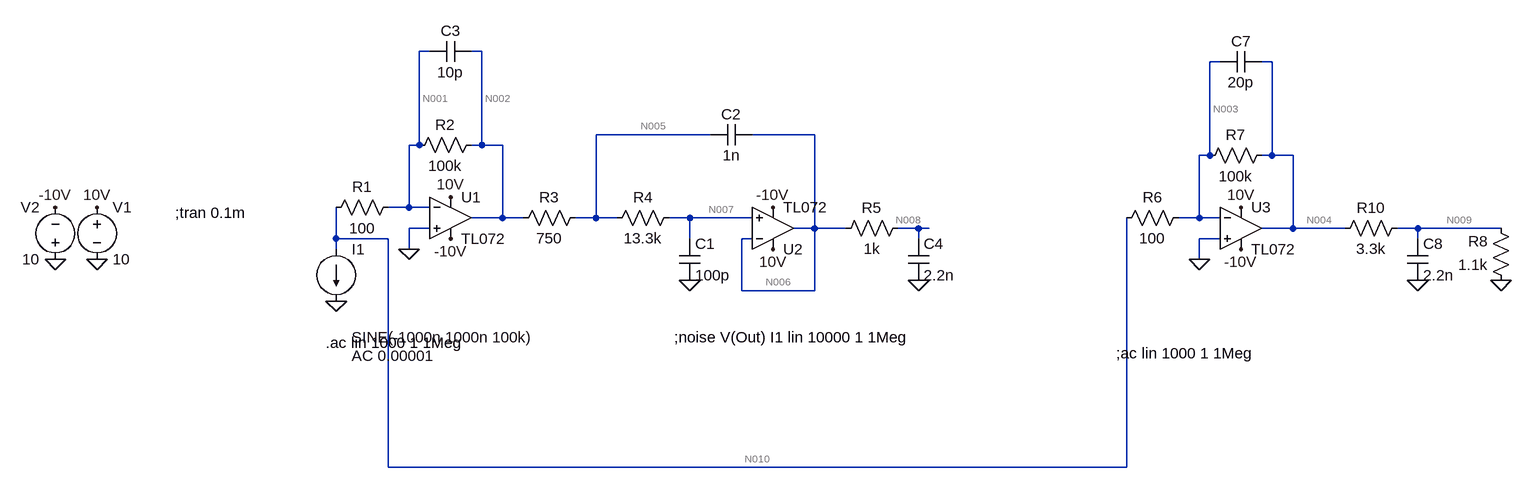
[diagram p0: schematic Model.asc]
Model.asc, the LTspice schematic file:
Version 4
SHEET 1 2156 680
WIRE 64 -96 48 -96
WIRE 144 -96 128 -96
WIRE 1280 -80 1264 -80
WIRE 1360 -80 1344 -80
WIRE 496 32 320 32
WIRE 656 32 560 32
WIRE 48 48 48 -96
WIRE 48 48 32 48
WIRE 144 48 144 -96
WIRE 144 48 128 48
WIRE 176 48 144 48
WIRE 1264 64 1264 -80
WIRE 1264 64 1248 64
WIRE 1360 64 1360 -80
WIRE 1360 64 1344 64
WIRE 1392 64 1360 64
WIRE 32 144 32 48
WIRE 32 144 0 144
WIRE 64 144 32 144
WIRE 176 160 176 48
WIRE 176 160 128 160
WIRE 208 160 176 160
WIRE 320 160 320 32
WIRE 320 160 288 160
WIRE 352 160 320 160
WIRE 464 160 432 160
WIRE 560 160 464 160
WIRE 1248 160 1248 64
WIRE 1248 160 1216 160
WIRE 1280 160 1248 160
WIRE 64 176 32 176
WIRE 656 176 656 32
WIRE 656 176 624 176
WIRE 704 176 656 176
WIRE 816 176 784 176
WIRE 832 176 816 176
WIRE 1392 176 1392 64
WIRE 1392 176 1344 176
WIRE 1472 176 1392 176
WIRE 1584 176 1552 176
WIRE 1712 176 1584 176
WIRE -80 192 -80 144
WIRE 0 192 -80 192
WIRE 464 192 464 160
WIRE 560 192 544 192
WIRE 816 192 816 176
WIRE 1280 192 1248 192
WIRE 1584 192 1584 176
WIRE -80 208 -80 192
WIRE 32 208 32 176
WIRE 1248 224 1248 192
WIRE 544 272 544 192
WIRE 656 272 656 176
WIRE 656 272 544 272
WIRE 0 544 0 192
WIRE 1136 544 1136 160
WIRE 1136 544 0 544
FLAG 32 208 0
FLAG -80 288 0
FLAG 96 128 10V
FLAG 96 192 -10V
FLAG -512 144 -10V
FLAG -448 144 10V
FLAG -512 224 0
FLAG -448 224 0
FLAG 592 208 10V
FLAG 592 144 -10V
FLAG 464 256 0
FLAG 816 256 0
FLAG 1248 224 0
FLAG 1312 144 10V
FLAG 1312 208 -10V
FLAG 1584 256 0
FLAG 1712 256 0
SYMBOL OpAmps\\TL072 96 96 R0
SYMATTR InstName U1
SYMBOL res 16 128 R90
WINDOW 0 0 56 VBottom 2
WINDOW 3 32 56 VTop 2
SYMATTR InstName R1
SYMATTR Value 100
SYMBOL res 144 32 R90
WINDOW 0 0 56 VBottom 2
WINDOW 3 32 56 VTop 2
SYMATTR InstName R2
SYMATTR Value 100k
SYMBOL current -80 208 R0
WINDOW 3 24 136 Left 2
WINDOW 123 24 164 Left 2
WINDOW 39 0 0 Left 0
SYMATTR Value SINE(-1000n 1000n 100k)
SYMATTR Value2 AC 0.00001
SYMATTR InstName I1
SYMBOL voltage -448 128 R0
WINDOW 123 0 0 Left 0
WINDOW 39 0 0 Left 0
SYMATTR InstName V1
SYMATTR Value 10
SYMBOL voltage -512 240 R180
WINDOW 0 24 96 Left 2
WINDOW 3 24 16 Left 2
WINDOW 123 0 0 Left 0
WINDOW 39 0 0 Left 0
SYMATTR InstName V2
SYMATTR Value 10
SYMBOL res 304 144 R90
WINDOW 0 0 56 VBottom 2
WINDOW 3 32 56 VTop 2
SYMATTR InstName R3
SYMATTR Value 750
SYMBOL OpAmps\\TL072 592 240 M180
SYMATTR InstName U2
SYMBOL res 448 144 R90
WINDOW 0 0 56 VBottom 2
WINDOW 3 32 56 VTop 2
SYMATTR InstName R4
SYMATTR Value 13.3k
SYMBOL cap 448 192 R0
SYMATTR InstName C1
SYMATTR Value 100p
SYMBOL cap 560 16 R90
WINDOW 0 0 32 VBottom 2
WINDOW 3 32 32 VTop 2
SYMATTR InstName C2
SYMATTR Value 1n
SYMBOL cap 128 -112 R90
WINDOW 0 0 32 VBottom 2
WINDOW 3 32 32 VTop 2
SYMATTR InstName C3
SYMATTR Value 10p
SYMBOL res 800 160 R90
WINDOW 0 0 56 VBottom 2
WINDOW 3 32 56 VTop 2
SYMATTR InstName R5
SYMATTR Value 1k
SYMBOL cap 800 192 R0
SYMATTR InstName C4
SYMATTR Value 2.2n
SYMBOL OpAmps\\TL072 1312 112 R0
SYMATTR InstName U3
SYMBOL res 1232 144 R90
WINDOW 0 0 56 VBottom 2
WINDOW 3 32 56 VTop 2
SYMATTR InstName R6
SYMATTR Value 100
SYMBOL res 1360 48 R90
WINDOW 0 0 56 VBottom 2
WINDOW 3 32 56 VTop 2
SYMATTR InstName R7
SYMATTR Value 100k
SYMBOL cap 1344 -96 R90
WINDOW 0 0 32 VBottom 2
WINDOW 3 32 32 VTop 2
SYMATTR InstName C7
SYMATTR Value 20p
SYMBOL res 1568 160 R90
WINDOW 0 0 56 VBottom 2
WINDOW 3 32 56 VTop 2
SYMATTR InstName R10
SYMATTR Value 3.3k
SYMBOL cap 1568 192 R0
SYMATTR InstName C8
SYMATTR Value 2.2n
SYMBOL res 1728 272 R180
WINDOW 0 36 76 Left 2
WINDOW 3 36 40 Left 2
SYMATTR InstName R8
SYMATTR Value 1.1k
TEXT -96 352 Left 2 !.ac lin 1000 1 1Meg
TEXT -328 152 Left 2 !;tran 0.1m
TEXT 440 344 Left 2 !;noise V(Out) I1 lin 10000 1 1Meg
TEXT 1120 368 Left 2 !;ac lin 1000 1 1Meg

The netlist it stands for:
* Model.asc
XU1 0 N001 10V -10V N002 TL072  ; pins In+ In- V+ V- OUT
R1 N001 N010 100
R2 N002 N001 100k
I1 N010 0 SINE(-1000n 1000n 100k) AC 0.00001
V1 10V 0 10
V2 0 -10V 10
R3 N005 N002 750
XU2 N007 N006 10V -10V N006 TL072  ; pins In+ In- V+ V- OUT
R4 N007 N005 13.3k
C1 N007 0 100p
C2 N006 N005 1n
C3 N002 N001 10p
R5 N008 N006 1k
C4 N008 0 2.2n
XU3 0 N003 10V -10V N004 TL072  ; pins In+ In- V+ V- OUT
R6 N003 N010 100
R7 N004 N003 100k
C7 N004 N003 20p
R10 N009 N004 3.3k
C8 N009 0 2.2n
R8 0 N009 1.1k
.ac lin 1000 1 1Meg
;tran 0.1m
;noise V(Out) I1 lin 10000 1 1Meg
;ac lin 1000 1 1Meg
.backanno
.end

* Results of the author's LTspice run, read from the files saved beside the schematic
* Operating Point, zero values left out:
*   V(n002) = -49.99 mV
*   V(-10v) = -10 V
*   V(10v) = 10 V
*   V(n001) = 11.19 µV
*   V(n010) = 61.2 µV
*   V(n005) = -49.99 mV
*   V(n006) = -49.98 mV
*   V(n007) = -49.99 mV
*   V(n008) = -49.98 mV
*   V(n004) = -49.98 mV
*   V(n003) = 11.2 µV
*   V(n009) = -12.49 mV
*   I(I1) = -1 µA
*   I(R8) = 11.36 µA
*   I(R10) = 11.36 µA
*   I(R7) = -499.9 nA
*   I(R6) = -499.9 nA
*   I(R4) = -40 pA
*   I(R3) = -40 pA
*   I(R2) = -500 nA
*   I(R1) = -500.1 nA
*   I(V2) = -28.58 mA
*   I(V1) = -28.58 mA
*   Ix(u1:1) = 40.05 pA
*   Ix(u1:2) = 40.05 pA
*   Ix(u1:3) = 9.528 mA
*   Ix(u1:4) = -9.528 mA
*   Ix(u1:5) = 500 nA
*   Ix(u2:1) = 40 pA
*   Ix(u2:2) = 40 pA
*   Ix(u2:3) = 9.528 mA
*   Ix(u2:4) = -9.528 mA
*   Ix(u2:5) = -40 pA
*   Ix(u3:1) = 40.05 pA
*   Ix(u3:2) = 40.05 pA
*   Ix(u3:3) = 9.528 mA
*   Ix(u3:4) = -9.528 mA
*   Ix(u3:5) = 11.86 µA
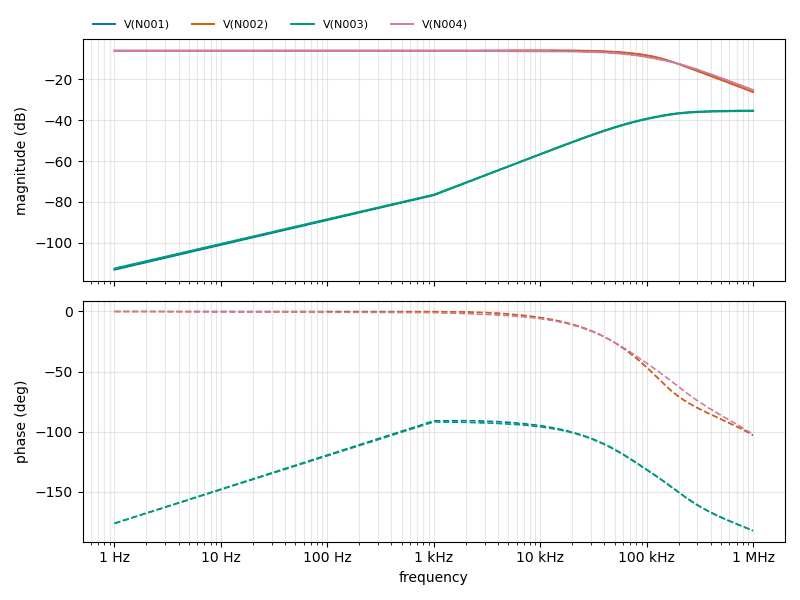
[diagram p1: AC Analysis of Model.asc, plotted from the saved traces]
* AC Analysis, 1 run:
*   V(N001): -113.19 dB at 1 Hz, -35.29 dB at 1 MHz, peak -35.29 dB at 1 MHz, 3 dB below the peak at 123.4 kHz
*   V(N002): -6.02 dB at 1 Hz, -26.20 dB at 1 MHz, peak -5.85 dB at 9.01 kHz, 3 dB below the peak at 115 kHz
*   V(N003): -112.62 dB at 1 Hz, -35.48 dB at 1 MHz, peak -35.48 dB at 1 MHz, 3 dB below the peak at 123.3 kHz
*   V(N004): -6.02 dB at 1 Hz, -25.19 dB at 1 MHz, peak -6.02 dB at 1 Hz, 3 dB below the peak at 98.84 kHz